# EAGLE schematic logic_brd_uni (EAGLE 9.0.0)
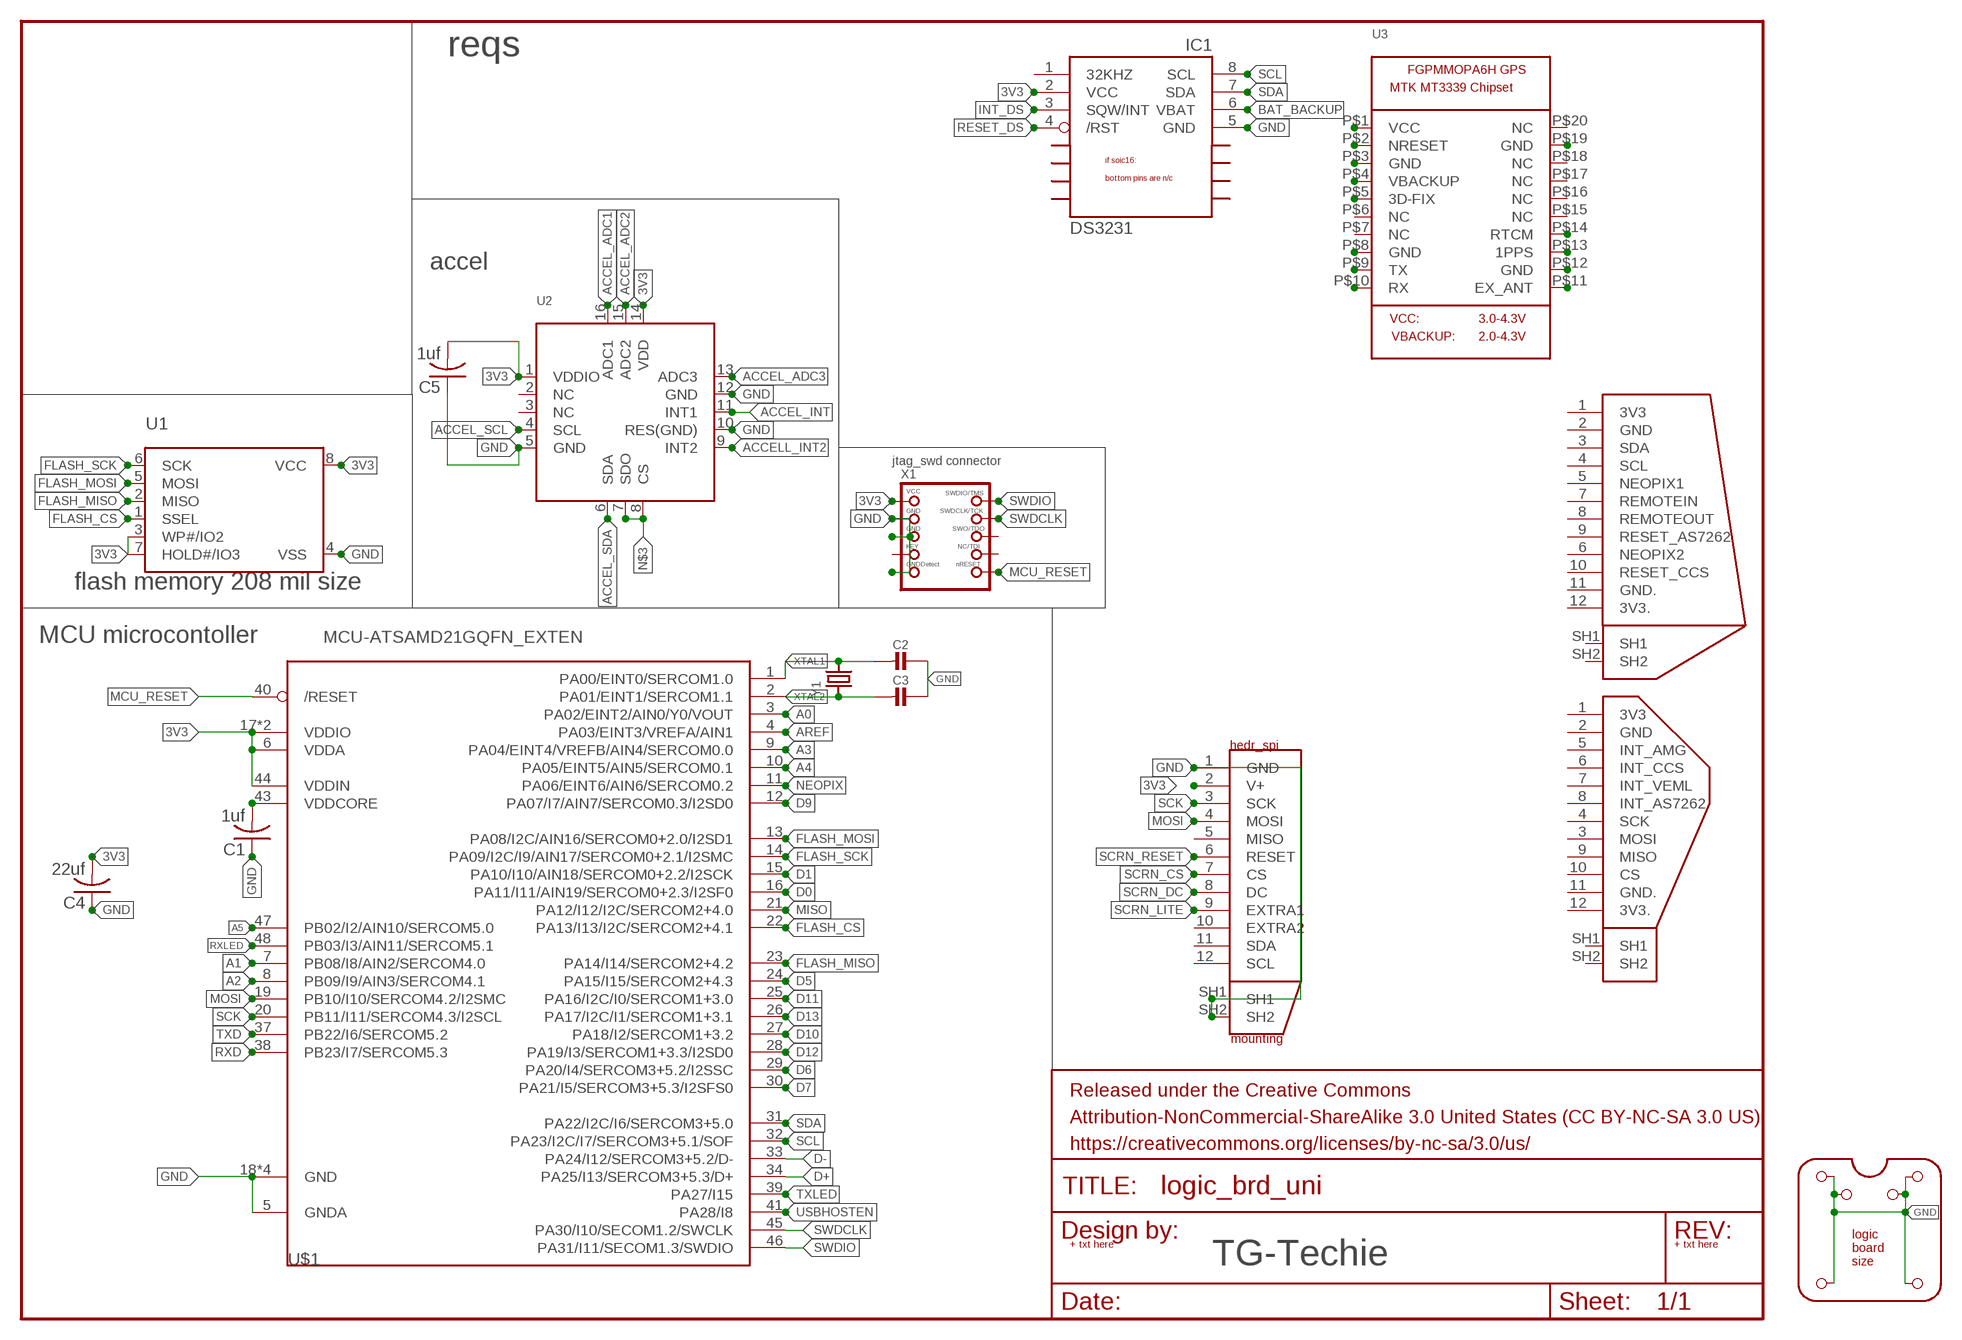
[diagram p0: schematic, sheet 1]

## Parts
C1  1uf  C-USC0805K  [C0805K]
C2  C-US_0805-NOOUTLINE  [MICROBUILDER_0805-NO]
C3  C-US_0805-NOOUTLINE  [MICROBUILDER_0805-NO]
C4  22uf  C-USC0805K  [C0805K]
C5  1uf  C-USC0805K  [C0805K]
FRAME1  LEDGER-TG-TECHIE-STANDARDNO_PACKAGE  [DUMMY]
IC1  SEN-TIME-DS3231-(PERSICION-TEMP)  [SOIC8_150MIL]
U1  SPIFLASH_SOIC8208MIL  [SOIC8_208MIL]
U2  ACCEL_LIS3DHTREXTEN  [LGA16_3X3MM_EXTENDED]
U3  GPS-ADA-V3-FGPMMOPA6HEXTEN  [MICROBUILDER_FGPMMOPA6H_EXTENDED]
U$1  MCU-ATSAMD21GQFN_EXTEN  [TQFN48_7MM_EXTENDED]
U$2  LOGIC-BRD  [LOGIC-BOARD]
U$3  HEDR-SEN-I2CMASTER_EXTEN  [FPC_TE_1-1734839-2_EXTENDED]
U$4  HEDR-SEN-INTMASTER_EXTEN  [FPC_TE_1-1734839-2_EXTENDED]
U$5  HEDR-SPI-FPC_12MASTER_EXTEN  [0TG-LIB-V01.1_FPC_TE_1-1734839-2_EXTENDED]
X1  INTRFC-JTAG-CORTEXBOXPOSTS  [2X05_1.27MM_BOX_POSTS]
Y1  XTAL_ADA4.9X1.8  [MICROBUILDER_CRYSTAL_4.9X1.8]

## Nets
3V3: C4.2 C5.2 IC1.2(VCC) U1.3(WP#/IO2) U1.7(HOLD#/IO3) U1.8(VCC) U2.1(VDDIO) U2.14(VDD) U$1.6(VDDA) U$1.17(VDDIO) U$1.36(VDDIO) U$1.44(VDDIN) U$5.2(V+) X1.1(VCC)
A0: U$1.3(PA02/EINT2/AIN0/Y0/VOUT)
A1: U$1.7(PB08/I8/AIN2/SERCOM4.0)
A2: U$1.8(PB09/I9/AIN3/SERCOM4.1)
A3: U$1.9(PA04/EINT4/VREFB/AIN4/SERCOM0.0)
A4: U$1.10(PA05/EINT5/AIN5/SERCOM0.1)
A5: U$1.47(PB02/I2/AIN10/SERCOM5.0)
ACCEL_ADC1: U2.16(ADC1)
ACCEL_ADC2: U2.15(ADC2)
ACCEL_ADC3: U2.13(ADC3)
ACCEL_INT: U2.11(INT1)
ACCEL_SCL: U2.4(SCL)
ACCEL_SDA: U2.6(SDA)
ACCELL_INT2: U2.9(INT2)
AREF: U$1.4(PA03/EINT3/VREFA/AIN1)
BAT_BACKUP: IC1.6(VBAT)
D0: U$1.16(PA11/I11/AIN19/SERCOM0+2.3/I2SF0)
D1: U$1.15(PA10/I10/AIN18/SERCOM0+2.2/I2SCK)
D5: U$1.24(PA15/I15/SERCOM2+4.3)
D6: U$1.29(PA20/I4/SERCOM3+5.2/I2SSC)
D7: U$1.30(PA21/I5/SERCOM3+5.3/I2SFS0)
D9: U$1.12(PA07/I7/AIN7/SERCOM0.3/I2SD0)
D10: U$1.27(PA18/I2/SERCOM1+3.2)
D11: U$1.25(PA16/I2C/I0/SERCOM1+3.0)
D12: U$1.28(PA19/I3/SERCOM1+3.3/I2SD0)
D13: U$1.26(PA17/I2C/I1/SERCOM1+3.1)
D+: U$1.34(PA25/I13/SERCOM3+5.3/D+)
D-: U$1.33(PA24/I12/SERCOM3+5.2/D-)
FLASH_CS: U1.1(SSEL) U$1.22(PA13/I13/I2C/SERCOM2+4.1)
FLASH_MISO: U1.2(MISO) U$1.23(PA14/I14/SERCOM2+4.2)
FLASH_MOSI: U1.5(MOSI) U$1.13(PA08/I2C/AIN16/SERCOM0+2.0/I2SD1)
FLASH_SCK: U1.6(SCK) U$1.14(PA09/I2C/I9/AIN17/SERCOM0+2.1/I2SMC)
GND: C1.1 C2.1 C3.1 C4.1 C5.1 IC1.5(GND) U1.4(VSS) U2.5(GND) U2.10(RES(GND)) U2.12(GND) U$1.5(GNDA) U$1.18(GND) U$1.35(GND) U$1.42(GND) U$1.THERMAL(GND) U$2.P$1 U$2.P$2 U$2.P$3 U$2.P$4 U$2.P$5 U$2.P$6 U$5.1(GND) U$5.SH1 U$5.SH2 X1.3(GND) X1.5(GND) X1.9(GNDDETECT)
INT_DS: IC1.3(SQW/INT)
MCU_RESET: U$1.40(/RESET) X1.10(NRESET)
MISO: U$1.21(PA12/I12/I2C/SERCOM2+4.0)
MOSI: U$1.19(PB10/I10/SERCOM4.2/I2SMC) U$5.4(MOSI)
N$1: C1.2 U$1.43(VDDCORE)
N$2: U3.P$11(EX_ANT)
N$3: U2.7(SDO) U2.8(CS)
N$4: U3.P$12(GND)
N$5: U3.P$13(1PPS)
N$6: U3.P$14(RTCM)
N$7: U3.P$19(GND)
N$8: U3.P$1(VCC)
N$9: U3.P$2(NRESET)
N$10: U3.P$3(GND)
N$11: U3.P$5(3D-FIX)
N$12: U3.P$4(VBACKUP)
N$13: U3.P$8(GND)
N$14: U3.P$9(TX)
N$15: U3.P$10(RX)
NEOPIX: U$1.11(PA06/EINT6/AIN6/SERCOM0.2)
RESET_DS: IC1.4(/RST)
RXD: U$1.38(PB23/I7/SERCOM5.3)
RXLED: U$1.48(PB03/I3/AIN11/SERCOM5.1)
SCK: U$1.20(PB11/I11/SERCOM4.3/I2SCL) U$5.3(SCK)
SCL: IC1.8(SCL) U$1.32(PA23/I2C/I7/SERCOM3+5.1/SOF)
SCRN_CS: U$5.7(CS)
SCRN_DC: U$5.8(DC)
SCRN_LITE: U$5.9(EXTRA1)
SCRN_RESET: U$5.6(RESET)
SDA: IC1.7(SDA) U$1.31(PA22/I2C/I6/SERCOM3+5.0)
SWDCLK: U$1.45(PA30/I10/SECOM1.2/SWCLK) X1.4(SWDCLK)
SWDIO: U$1.46(PA31/I11/SECOM1.3/SWDIO) X1.2(SWDIO)
TXD: U$1.37(PB22/I6/SERCOM5.2)
TXLED: U$1.39(PA27/I15)
USBHOSTEN: U$1.41(PA28/I8)
XTAL1: C2.2 U$1.1(PA00/EINT0/SERCOM1.0) Y1.2
XTAL2: C3.2 U$1.2(PA01/EINT1/SERCOM1.1) Y1.1
Unconnected: IC1.1(32KHZ) U2.2(NC) U2.3(NC) U3.P$6(NC) U3.P$7(NC) U3.P$15(NC) U3.P$16(NC) U3.P$17(NC) U3.P$18(NC) U3.P$20(NC) U$3.1(3V3) U$3.2(GND) U$3.3(SDA) U$3.4(SCL) U$3.5(NEOPIX1) U$3.6(NEOPIX2) U$3.7(REMOTEIN) U$3.8(REMOTEOUT) U$3.9(RESET_AS7262) U$3.10(RESET_CCS) U$3.11(GND.) U$3.12(3V3.) U$3.SH1 U$3.SH2 U$4.1(3V3) U$4.2(GND) U$4.3(MOSI) U$4.4(SCK) U$4.5(INT_AMG) U$4.6(INT_CCS) U$4.7(INT_VEML) U$4.8(INT_AS7262) U$4.9(MISO) U$4.10(CS) U$4.11(GND.) U$4.12(3V3.) U$4.SH1 U$4.SH2 U$5.5(MISO) U$5.10(EXTRA2) U$5.11(SDA) U$5.12(SCL) X1.6(SWO) X1.7(KEY) X1.8(TDI)

## Notes on the sheet
- reqs
- accel
- jtag_swd connector
- flash memory 208 mil size
- MCU microcontoller
- TG-Techie

## Library data of the parts
C1 C4 C5 = 0TG-Lib v01.0:C-US: CAPACITOR, American symbol from: eaglecad RCL
C2 C3 = 0TG-Lib v01.2:C-US_: from: microbuilder Ceramic Capacitors For new designs, use the packages preceded by an '_' character since they are more reliable: The following footprints should be used on most boards: _0402 - Standard footprint for regular board layouts _0603 - Standard footprint for regular board layouts _0805 - Standard footprint for regular board layouts _1206 - Standard footprint for regular board layouts For extremely tight-pitch boards where space is at a premium, the following 'micro-pitch' footprints can be used (smaller pads, no silkscreen outline, etc.): _0402MP - Micro-pitch footprint for very dense/compact boards _0603MP - Micro-pitch footprint for very dense/compact boards _0805MP - Micro-pitch footprint for very dense/compact boards _1206MP - Micro-pitch footprint for very dense/compact boards
FRAME1 = 0TG-Lib v01.0:LEDGER-TG-TECHIE-STANDARD: Schematic Frame - Letter Standard 8.5x11 US Letter frame from: sparkfun; DESIGNER: Nobody; VERSION: v01
IC1 = 0TG-Lib v01.2:SEN-TIME-DS3231-(PERSICION-TEMP): from: adafruit altered for this library by: TG-Techie
U1 = 0TG-Lib v01.0:SPIFLASH_SOIC8: SOIC8 SPI Flash Be careful with the size since SOIC8 flash comes in several 'widths' SOIC8 150 mil M25P16 - 16Mbit (2Mbit x 8) Serial Flash (75MHz SPI Bus), Supply: 2.7-3.6V Digikey: SOIC8 - M25P16-VMN6P-ND SOIC8 208 mil W25Q16BVSSIG - 16Mbit (2Mbit x 8) Serial Flash (104MHz SPI Bus), Supply: 2.7-3.6V Digikey: SOIC8 - W25Q16BVSSIG-ND from: adafruit availability low
U2 = 0TG-Lib v01.0:ACCEL_LIS3DHTR: from: adafruit LIS3DHTR 3-Axis Accelerometer with I2C/SPI Interface VDD: 1.71-3.6V VDDIO: 1.71-VDD+0.1V Scale: +/-2g, 4g, 8g, 16g with 16--bit data output Temp:: -40°C - 85°C Mouser: 511-LIS3DHTR Digikey: 497-10613-1-ND
U3 = 0TG-Lib v01.2:GPS-ADA-V3-FGPMMOPA6H: from: adafruit link: https://www.adafruit.com/product/790 GPS Module - MTK MT3339 Chipset, -165dBm sensitivity, 22 channels, 10Hz, auto-select external antenna options
U$1 = 0TG-Lib v01.0:MCU-ATSAMD21G: from: various
U$2 = 0Trico04_lib:LOGIC-BRD
U$3 = 0Trico04_lib:HEDR-SEN-I2C
U$4 = 0Trico04_lib:HEDR-SEN-INT
U$5 = 0TG-Lib v01.2:HEDR-SPI-FPC_12
X1 = 0TG-Lib v01.2:INTRFC-JTAG-CORTEX: from: adafruit Serial Wire (SW-DP) Connector Standard 0.05" 10-pin connector is for use with the Cortex M and Cortex A SWD (serial wire debugger) interface (SW-DP) Connectors 2x05_1.27MM_SMT - Inexpensive surface-mount header with bare pins, compatible with standard 10-pin SWD cables (4UCON: 16846) 2x05_1.27MM_BOX_NOPOSTS - Polarised surface-mount box (4UCON with caps: 19735, without caps: 15117 2x05_1.27MM_BOX_POSTS - Polarised surface-mount box with mounting holes (4UCON: 20317) Pinout: http://infocenter.arm.com/help/topic/com.arm.doc.faqs/attached/13634/cortex_debug_connectors.pdf http://www.keil.com/peripherals/coresight/connectors.asp
Y1 = 0TG-Lib v01.2:XTAL_ADA: Crystals HC49UP - Surface Mount Crystal 4.0MHz 18pF +/-30ppm Surface Mount Crystal [Digikey: 535-9857-1-ND] 12.0 MHz Surface Mount Crystal [Digikey: 535-9869-6-ND] 25.0 MHz Surface Mount Crystal [Digikey: 535-9078-1-ND] 2.5 x 2.0mm - MEMs SMT Crystal 16.0 MHz 10pF 20ppm 2.5 x 2.0mm Crystal [Digikey -40-85°C: 535-10923-1-ND] 3.2 x 2.5mm - MEMs SMT Crystal 12.0 MHz 8pF 15ppm 3.2 x 2.5mm Crystal [Digikey: -10-70°C: 644-1047-1-ND -40-125°C: 644-1128-1-ND] 16.0 MHz 8pF 15ppm 3.2 x 2.5mm Crystal [Digikey: -10-70°C: 644-1049-1-ND -40-125°C: 644-1129-2-ND] 16.0 MHz 10pF 10ppm 3.2 x 2.5mm Crystal [Digikey: 644-1100-1-ND] 27.12 MHz 18pF 30ppm 3.2 x 2.5mm Crystal [Digikey: 887-1424-1-ND] 27.12MHz 10pF 10ppm 3.2 x 2.5mm Crystal [Digikey: 887-1329-1-ND] 4.9 x 1.8mm - MEMs SMT Crystal 32.768 KHz 12.5pF 20ppm 4.9 x 1.8mm Crystal [Digikey: SE2415CT-ND] 8.0 x 3.8mm - Surface Mount Crystal 32.768kHz 12.5pF 20ppm -40°C-85°C [Digikey: 535-9166-2-ND] Cylinder 32.768KHz Cylinder Crystal (2x6mm body) [Ex. Digikey: 300-8341-2-ND]